# Altium schematic sheet Sensor_ExpandBoard_W25Q64.SchDoc: Sensor Card
size A4; Revision: V1.1; SheetNumber: 1; SheetTotal: 7; Function: SPI FLASH
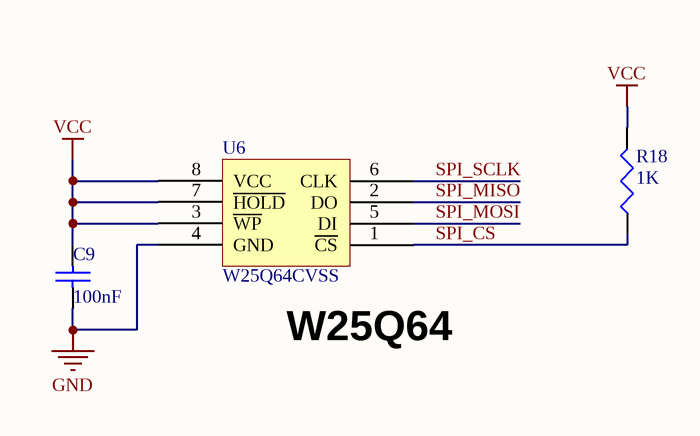
[diagram p0: Sensor_ExpandBoard_W25Q64.SchDoc]

## Parts
C9  100nF  [0603-2]
R18  1K  [R0603]
U6  W25Q64CVSS  [SOIC8]

## Nets
GND: C9.2 U6.4(GND)
VCC: C9.1 R18.2 U6.3(~{WP}) U6.7(~{HOLD}) U6.8(VCC)
SPI_~{CS}: R18.1 U6.1(~{CS})
SPI_MISO: U6.2(DO)
SPI_MOSI: U6.5(DI)
SPI_SCLK: U6.6(CLK)

## Notes on the sheet
- (near U6) W25Q64
- 工程名称：
- 图纸大小：
- 日期：
- A4
- 版本号：
- 页码：
- 第
- 共
- 制图：
- 审核：

## Library data of the parts
C9 = Cap: 无极性电容; Published: 8-Jun-2000; LatestRevisionDate: 17-Jul-2002; LatestRevisionNote: Re-released for DXP Platform.; PackageReference: RAD-0.3; Publisher: Altium Limited; Value: 100nF
R18 = Res: Resistor; Published: 8-Jun-2000; LatestRevisionDate: 29-May-2009; LatestRevisionNote: IPC-7351 Footprint Added.; PackageReference: J1-0603; Publisher: Altium Limited; PackageDescription: Chip Resistor; Value: 1K
U6 = W25Q64: Quad SPI Flash,64Mb,SOIC8; Value: W25Q64CVSS